# EAGLE design cherrymx1 (EAGLE 7.2.0)
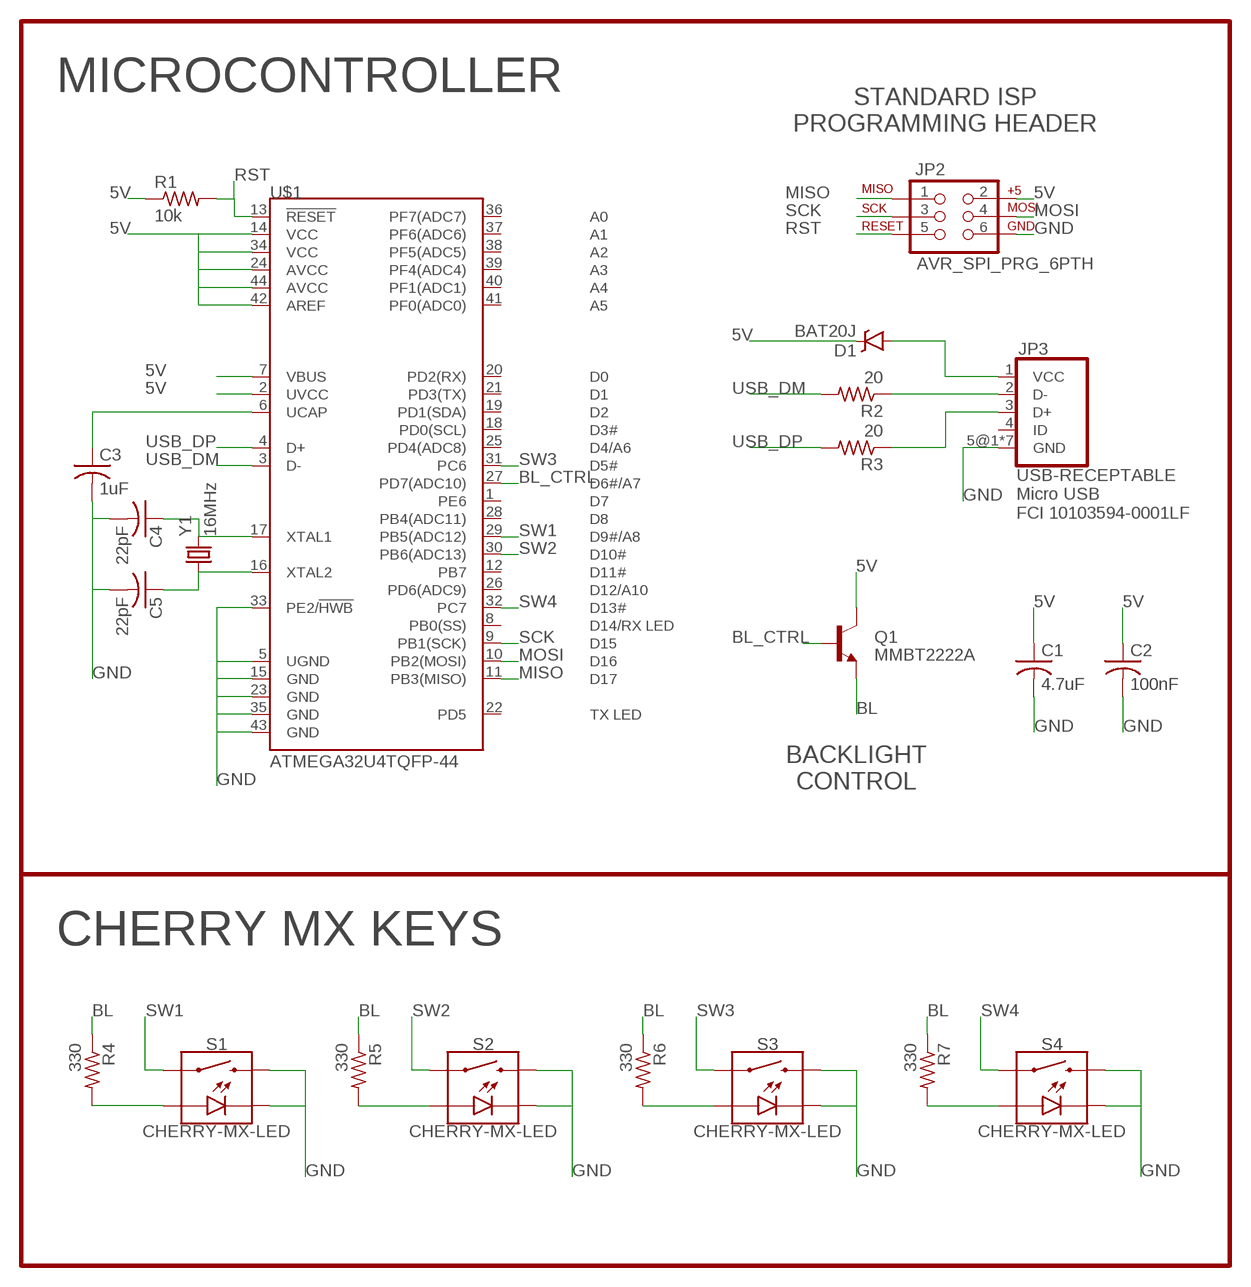
[diagram p0: schematic, sheet 1]

## Parts
C1  4.7uF  C-USC0603  [C0603]
C2  100nF  C-USC0603  [C0603]
C3  1uF  C-USC0603  [C0603]
C4  22pF  C-USC0603  [C0603]
C5  22pF  C-USC0603  [C0603]
D1  BAT20J  DIODE-SCHOTTKY-BAT20J  [SOD-323]
JP2  AVR_SPI_PRG_6PTH  [2X3]
JP3  USB-RECEPTABLE  [FCI-10103594-0001LF]
Q1  MMBT2222A  TRANSISTOR_NPNMMBT2222A  [SOT23-3]
R1  10k  R-US_R0603  [R0603]
R2  20  R-US_R0603  [R0603]
R3  20  R-US_R0603  [R0603]
R4  330  R-US_R0603  [R0603]
R5  330  R-US_R0603  [R0603]
R6  330  R-US_R0603  [R0603]
R7  330  R-US_R0603  [R0603]
S1  CHERRY-MX-LED  [CHERRY-MX-LED]
S2  CHERRY-MX-LED  [CHERRY-MX-LED]
S3  CHERRY-MX-LED  [CHERRY-MX-LED]
S4  CHERRY-MX-LED  [CHERRY-MX-LED]
U$1  ATMEGA32U4TQFP-44  [TQFP44]
Y1  16MHz  CRYSTAL5X3  [CRYSTAL-SMD-5X3]

## Nets
5V: C1.1 C2.1 D1.C JP2.2 Q1.3(C) R1.1 U$1.2(UVCC) U$1.7(VBUS) U$1.14(VCC) U$1.24(AVCC) U$1.34(VCC) U$1.42(AREF) U$1.44(AVCC)
BL: Q1.2(E) R4.1 R5.1 R6.1 R7.1
BL_CTRL: Q1.1(B) U$1.27(PD7(ADC10))
GND: C1.2 C2.2 C3.2 C4.2 C5.2 JP2.6 JP3.5@1(GND) JP3.5@2(GND) JP3.5@3(GND) JP3.5@4(GND) JP3.5@5(GND) JP3.5@6(GND) JP3.5@7(GND) S1.K(C) S1.S2 S2.K(C) S2.S2 S3.K(C) S3.S2 S4.K(C) S4.S2 U$1.5(UGND) U$1.15(GND) U$1.23(GND) U$1.33(PE2/!HWB) U$1.35(GND) U$1.43(GND)
MISO: JP2.1 U$1.11(PB3(MISO))
MOSI: JP2.4 U$1.10(PB2(MOSI))
N$1: D1.A JP3.1(VCC)
N$2: JP3.2(D-) R2.1
N$3: JP3.3(D+) R3.1
N$5: C3.1 U$1.6(UCAP)
N$6: C4.1 U$1.17(XTAL1) Y1.3
N$8: C5.1 U$1.16(XTAL2) Y1.1
N$9: R4.2 S1.A
N$10: R6.2 S3.A
N$11: R7.2 S4.A
N$12: R5.2 S2.A
RST: JP2.5 R1.2 U$1.13(!RESET)
SCK: JP2.3 U$1.9(PB1(SCK))
SW1: S1.S1 U$1.29(PB5(ADC12))
SW2: S2.S1 U$1.30(PB6(ADC13))
SW3: S3.S1 U$1.31(PC6)
SW4: S4.S1 U$1.32(PC7)
USB_DM: R2.2 U$1.3(D-)
USB_DP: R3.2 U$1.4(D+)
Unconnected: JP3.4(ID) U$1.1(PE6) U$1.8(PB0(SS)) U$1.12(PB7) U$1.18(PD0(SCL)) U$1.19(PD1(SDA)) U$1.20(PD2(RX)) U$1.21(PD3(TX)) U$1.22(PD5) U$1.25(PD4(ADC8)) U$1.26(PD6(ADC9)) U$1.28(PB4(ADC11)) U$1.36(PF7(ADC7)) U$1.37(PF6(ADC6)) U$1.38(PF5(ADC5)) U$1.39(PF4(ADC4)) U$1.40(PF1(ADC1)) U$1.41(PF0(ADC0))

## Notes on the sheet
- MICROCONTROLLER
- STANDARD ISP
  PROGRAMMING HEADER
- Micro USB
  FCI 10103594-0001LF
- BACKLIGHT
  CONTROL
- CHERRY MX KEYS

## Library data of the parts
C1-C5 = adafruit:C-US: CAPACITOR, American symbol
D1 = SparkFun-DiscreteSemi:DIODE-SCHOTTKY: Schottky diodes in SFE's production catalog BAT20J 1A 23V 0.62Vf RB751 120mA 40V 0.37Vf PMEG4005EJ 0.5A 40V 0.42Vf MBRA140 1A 40V 0.5Vf B340A 3A 40V SMA; PROD_ID: DIO-11623
JP2 = SparkFun-Connectors:AVR_SPI_PRG_6: AVR ISP 6 Pin This is the reduced ISP connector for AVR programming. Common on Arduino. This footprint will take up less PCB space and can be used with a 10-pin to 6-pin adapter such as SKU: BOB-08508 **Special note about "TEST_POINT" package. The stop mask is on the top side, so if you want your programming test points to be on the bottom of your board, make sure to place this package on the bottom side of the board. This also ensure that the orientation to program from the bottom side will be correct.
JP3 = daspilker:USB-RECEPTABLE: USB Receptable
Q1 = SparkFun-DiscreteSemi:TRANSISTOR_NPN: Generic NPN BJT MMBT2222A - TRANS-08049 (SOT-23, 1A 40V) MPSA42 - TRANS-09116 (SOT-23, 500mA 300V) MMBT5088LT1G - TRANS-11160 (SOT-23, 50 mA 30V) BC547 - COM-08928 <http://www.sparkfun.com/products/8928> (TO-92 45V 100mA) (1.Collector 2.Base 3.Emitter) 2N3904 - COM-00521 <http://www.sparkfun.com/products/521> (TO-92 40V 200mA) (1.Emitter 2.Base 3.Collector) P2N2222A - COM-12852 <http://www.sparkfun.com/products/12852> (TO-92 40V 600mA) (1.Collector 2.Base 3.Emitter); PROD_ID: TRANS-08049
R1-R7 = adafruit:R-US_: RESISTOR, American symbol
S1-S4 = SparkFun-Electromechanical2:CHERRY-MX-LED: Cherry MX Switch - Electromechanical Swith w/ LED Cherry MX Keyswitches are top-of-the-line mechanical keyboard switches. They’re satisfyingly “clicky”, reliable up to tens-of-millions of key presses, and a standard in gaming and programming keyboards across the globe. This ‘blue’ version Cherry MX Switch is favored by most due to its secondary internal actuator making it less likely to “double-tap.” If you are looking for a noticeably audible and high-quality key switch, this is the perfect option for you! SparkFun Product Link <https://www.sparkfun.com/products/13834>; SF_ID: COM-13834
U$1 = SparkFun-DigitalIC:ATMEGA32U4: Atmel 44-pin 8-bit Microcontroller with 32KBytes of ISP Flash and USB Controller
Y1 = SparkFun-FreqCtrl:CRYSTAL: Various standard crystals. Proven footprints.; PROD_ID: XTAL-08218

## Board
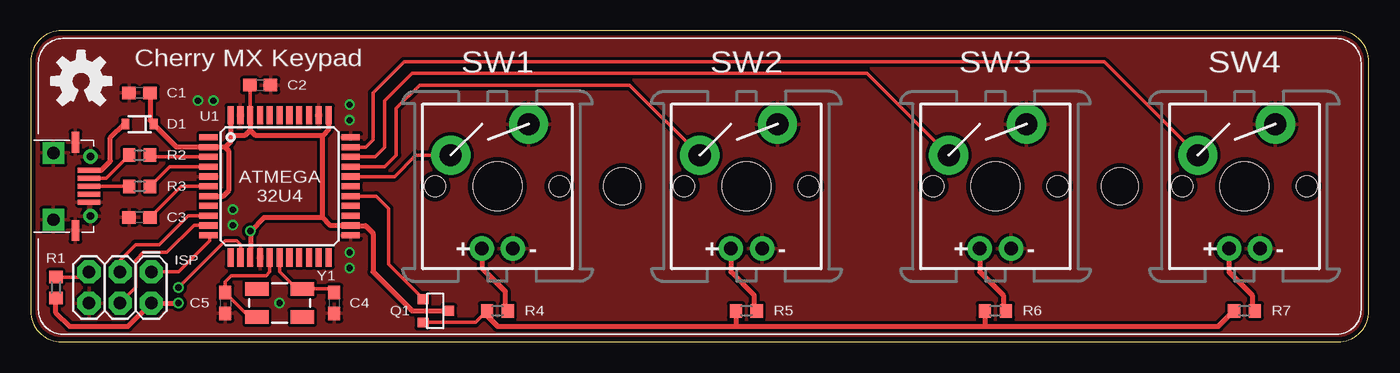
[diagram p1: board, top side]
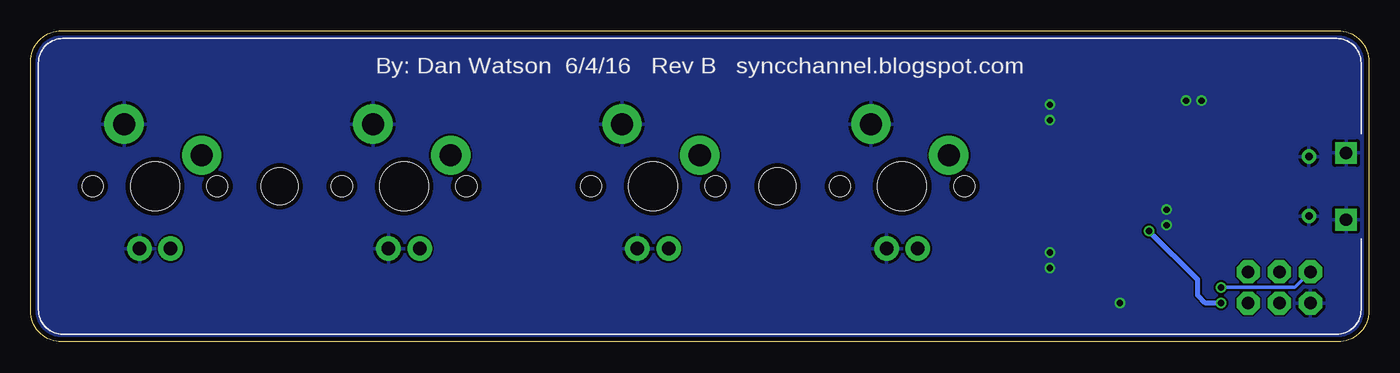
[diagram p2: board, bottom side, seen from below]

Size 109.22 x 25.4 mm. Coordinates in mm from the lower left corner, seen from the top.
Outline: 0,22.86 0,2.54 arc90 2.54,0 106.68,0 arc90 109.22,2.54 109.22,22.86 arc90 106.68,25.4 2.54,25.4 arc90 0,22.86
Copper layers (1*16): Top 0.0356mm / dielectric 1.5011mm / Bottom 0.0356mm
Design rules "oshpark-2layer *": minimum track width 6mil, minimum drill 13mil, track to track 6mil, track to pad 6mil, pad to pad 6mil, via to via 6mil, smd to smd 6mil, copper to edge 15mil, drill to drill 6mil, minimum pad ring 7mil, minimum via ring 7mil, stop-mask expansion 4mil, vias tented up to drill 20mil, thermal gap 10mil
Holes 3 mm at 48.26,12.7 88.9,12.7

### Footprints (pad centres in the part's own frame; a part is rotated, then mirrored left to right if it is on the bottom)
C0603 = smd 1.1 x 1: 1 -0.85,0; 2 0.85,0
SOD-323 = smd 0.63 x 0.83: A 1.15,0; C -1.15,0
2X3 = drill 1.016 pad 1.88 octagon: 1 0,0; 2 0,2.54; 3 2.54,0; 4 2.54,2.54; 5 5.08,0; 6 5.08,2.54
FCI-10103594-0001LF = smd 0.4 x 1.8: 1 -1.3,4.6; 2 -0.65,4.6; 3 0,4.6; 4 0.65,4.6; 5@1 1.3,4.6 | drill 0.6 pad 1.2: 5@2 -2.425,4.73; 5@3 2.425,4.73 | drill 1 pad 1.778 square: 5@4 -2.725,1.7; 5@5 2.725,1.7 | smd 1.7 x 0.635: 5@6 -3.6,3.5; 5@7 3.6,3.5
SOT23-3 = smd 0.8 x 0.9: 1 -0.95,-1; 2 0.95,-1; 3 0,1.1
R0603 = smd 1 x 1.1: 1 -0.85,0; 2 0.85,0
CHERRY-MX-LED = drill 1.1 pad 2: A -1.27,-5.08; K 1.27,-5.08 | drill 1.8 pad 3.2: S1 -3.81,2.54; S2 2.54,5.08 | hole 4: 0,0 | hole 1.7: -5.08,0; 5.08,0
TQFP44 = smd 1.5 x 0.5: 1 -5.8,4; 2 -5.8,3.2; 3 -5.8,2.4; 4 -5.8,1.6; 5 -5.8,0.8; 6 -5.8,0; 7 -5.8,-0.8; 8 -5.8,-1.6; 9 -5.8,-2.4; 10 -5.8,-3.2; 11 -5.8,-4; 23 5.8,-4; 24 5.8,-3.2; 25 5.8,-2.4; 26 5.8,-1.6; 27 5.8,-0.8; 28 5.8,0; 29 5.8,0.8; 30 5.8,1.6; 31 5.8,2.4; 32 5.8,3.2; 33 5.8,4 | smd 0.5 x 1.5: 12 -4,-5.8; 13 -3.2,-5.8; 14 -2.4,-5.8; 15 -1.6,-5.8; 16 -0.8,-5.8; 17 0,-5.8; 18 0.8,-5.8; 19 1.6,-5.8; 20 2.4,-5.8; 21 3.2,-5.8; 22 4,-5.8; 34 4,5.8; 35 3.2,5.8; 36 2.4,5.8; 37 1.6,5.8; 38 0.8,5.8; 39 0,5.8; 40 -0.8,5.8; 41 -1.6,5.8; 42 -2.4,5.8; 43 -3.2,5.8; 44 -4,5.8
CRYSTAL-SMD-5X3 = smd 1.9 x 1.1: 1 -1.85,-1.15; 2 1.85,-1.15; 3 1.85,1.15; 4 -1.85,1.15

### Placement (x,y rotation side)
C1  8.89,20.32 180 top
C2  18.73,20.95 0 top
C3  8.89,10.16 180 top
C4  24.77,3.17 270 top
C5  15.88,3.17 270 top
D1  8.89,17.78 180 top
JP2  9.84,5.71 180 top
JP3  0.16,12.7 270 top
Q1  33.02,2.54 270 top
R1  2.06,4.45 90 top
R2  8.89,15.24 0 top
R3  8.89,12.7 0 top
R4  38.1,2.54 0 top
R5  58.42,2.54 0 top
R6  78.74,2.54 0 top
R7  99.06,2.54 0 top
S1  38.1,12.7 0 top
S2  58.42,12.7 0 top
S3  78.74,12.7 0 top
S4  99.06,12.7 0 top
U$1  20.32,12.7 0 top
U$2  [OSHW-LOGO-M]  4.13,21.27 0 top
Y1  20.32,3.17 0 top

### Tracks (layer width: path | path; a pad name or v marks a point on that pad's centre or on a via)
5V  (via drill 0.5)
  Top 0.305: 14.54,15.88 U$1.2 | U$1.42 17.92,20.92 C2.1
  Top 0.406: U$1.2 11.92,15.9 D1.C 9.74,18.08 C1.1 | U$1.44 16.32,16.83 | 16.32,16.83 16.32,16.32 15.88,15.88 | 15.88,15.88 14.54,15.88 | U$1.42 17.92,17.29 | 17.92,17.29 17.46,16.83 16.32,16.83 | U$1.34 24.32,17.34 23.81,16.83 | 23.81,16.83 18.38,16.83 17.92,17.29 | 23.81,10.16 24.47,9.5 U$1.24 27.33,9.5 27.94,8.89 27.94,5.71 31.11,2.54 Q1.3 | 23.81,10.16 23.81,16.83 | 23.81,10.16 19.05,10.16 v17.94,9.05 17.94,6.92 U$1.14 | U$1.7 15.71,11.9 16.19,12.38 16.19,15.56 15.88,15.88 | v12.06,3.17 JP2.2 7.94,1.27 3.17,1.27 2.06,2.38 R1.1
  Bottom 0.406: v12.06,3.17 13.34,3.17 13.97,3.81 13.97,5.08 v17.94,9.05
BL
  Top 0.305: Q1.2 36.3,1.59 R4.1
  Top 0.406: R4.1 37.25,2.12 38.1,1.27 57.47,1.27 | 57.47,1.27 77.79,1.27 | 77.79,1.27 96.94,1.27 R7.1 | R6.1 77.89,1.37 77.79,1.27 | R5.1 57.57,1.37 57.47,1.27
BL_CTRL
  Top 0.305: U$1.27 28.2,11.9 29.21,10.88 29.21,6.35 32.02,3.54 Q1.1
GND  (via drill 0.5)
  other vias: 20.32,3.17 16.51,9.53 16.51,10.79 26.04,18.1 26.04,19.37 26.04,7.3 26.04,6.03 14.92,19.68 13.65,19.68
  pour Top (isolate 0.254): -2.54,27.94 -2.54,-2.54 113.03,-2.54 113.03,29.21 -2.54,29.21
  pour Bottom: -5.08,31.75 -5.08,-5.08 115.57,-5.08 115.57,31.75
MISO
  Top 0.305: JP2.1 12.06,5.71 14.61,8.26 14.61,8.62 U$1.11
MOSI
  Top 0.305: JP2.4 8.57,4.45 8.57,6.67 9.21,7.3 11.11,7.3 13.34,9.53 14.49,9.53 U$1.10
N$1
  Top 0.305: D1.A 7.62,17.78
  Top 0.406: 7.62,17.78 6.51,16.67 6.51,14.76 5.75,14 JP3.1
N$2
  Top 0.305: JP3.2 6.15,13.35 R2.1
N$3
  Top 0.305: JP3.3 R3.1
N$5
  Top 0.305: U$1.6 12.28,12.7 C3.1
N$6
  Top 0.305: U$1.17 20.32,5.71 21.71,4.33 Y1.3 24.46,4.33 C4.1
N$8
  Top 0.305: U$1.16 19.52,5.71 19.21,5.4 16.35,5.4 15.88,4.92 C5.1 17.88,2.02 Y1.1
N$9
  Top 0.406: S1.A 36.83,6.03 38.73,4.13 38.73,2.75 R4.2
N$10
  Top 0.406: S3.A 77.47,5.71 79.38,3.81 79.38,2.75 R6.2
N$11
  Top 0.406: S4.A 97.79,5.71 99.69,3.81 99.69,2.75 R7.2
N$12
  Top 0.406: S2.A 57.15,5.71 59.05,3.81 59.05,2.75 R5.2
RST  (via drill 0.5)
  Top 0.305: JP2.5 4.34,5.29 R1.2 | v12.06,4.45 15.88,8.26 16.83,8.26 17.14,7.94 17.14,6.92 U$1.13
  Bottom 0.305: JP2.5 6.03,4.45 v12.06,4.45
SCK
  Top 0.305: U$1.9 12.84,10.3 10.48,7.94 8.57,7.94 7.3,6.67 JP2.3
SW1
  Top 0.305: U$1.29 29.69,13.5 31.43,15.24 S1.S1
SW2
  Top 0.305: U$1.30 28.91,14.3 29.84,15.24 29.84,19.05 31.75,20.95 48.9,20.95 S2.S1
SW3
  Top 0.305: U$1.31 28.12,15.1 28.89,15.88 28.89,19.68 31.11,21.91 68.26,21.91 S3.S1
SW4
  Top 0.305: U$1.32 27.33,15.9 27.94,16.51 27.94,20.32 30.48,22.86 87.63,22.86 S4.S1
USB_DM
  Top 0.305: U$1.3 9.88,15.1 R2.2
USB_DP
  Top 0.305: U$1.4 11.34,14.3 R3.2

### Text on the board
tNames: Cherry MX Keypad | SW1 | SW2 | SW3 | SW4 | C2 | C1 | D1 | U1 | R2 | R3 | ATMEGA / 32U4 | C3 | R1 | ISP | Y1 | C5 | C4 | Q1 | R4 | R5 | R6 | R7
bNames: By: Dan Watson 6/4/16 Rev B syncchannel.blogspot.com